# EasyEDA Pro project 25集创赛海云捷讯杯.epro, schematic Schematic1
Board Name: AWC_C4&征途连接板; Create Date: 2025-03-02; Page Name: P1; Project Name: 25集创赛海云捷讯杯; Schematic Name: Schematic1; Update Date: 2025-03-21; Company: 嘉立创EDA; Page Size: A4; Version: V1.0
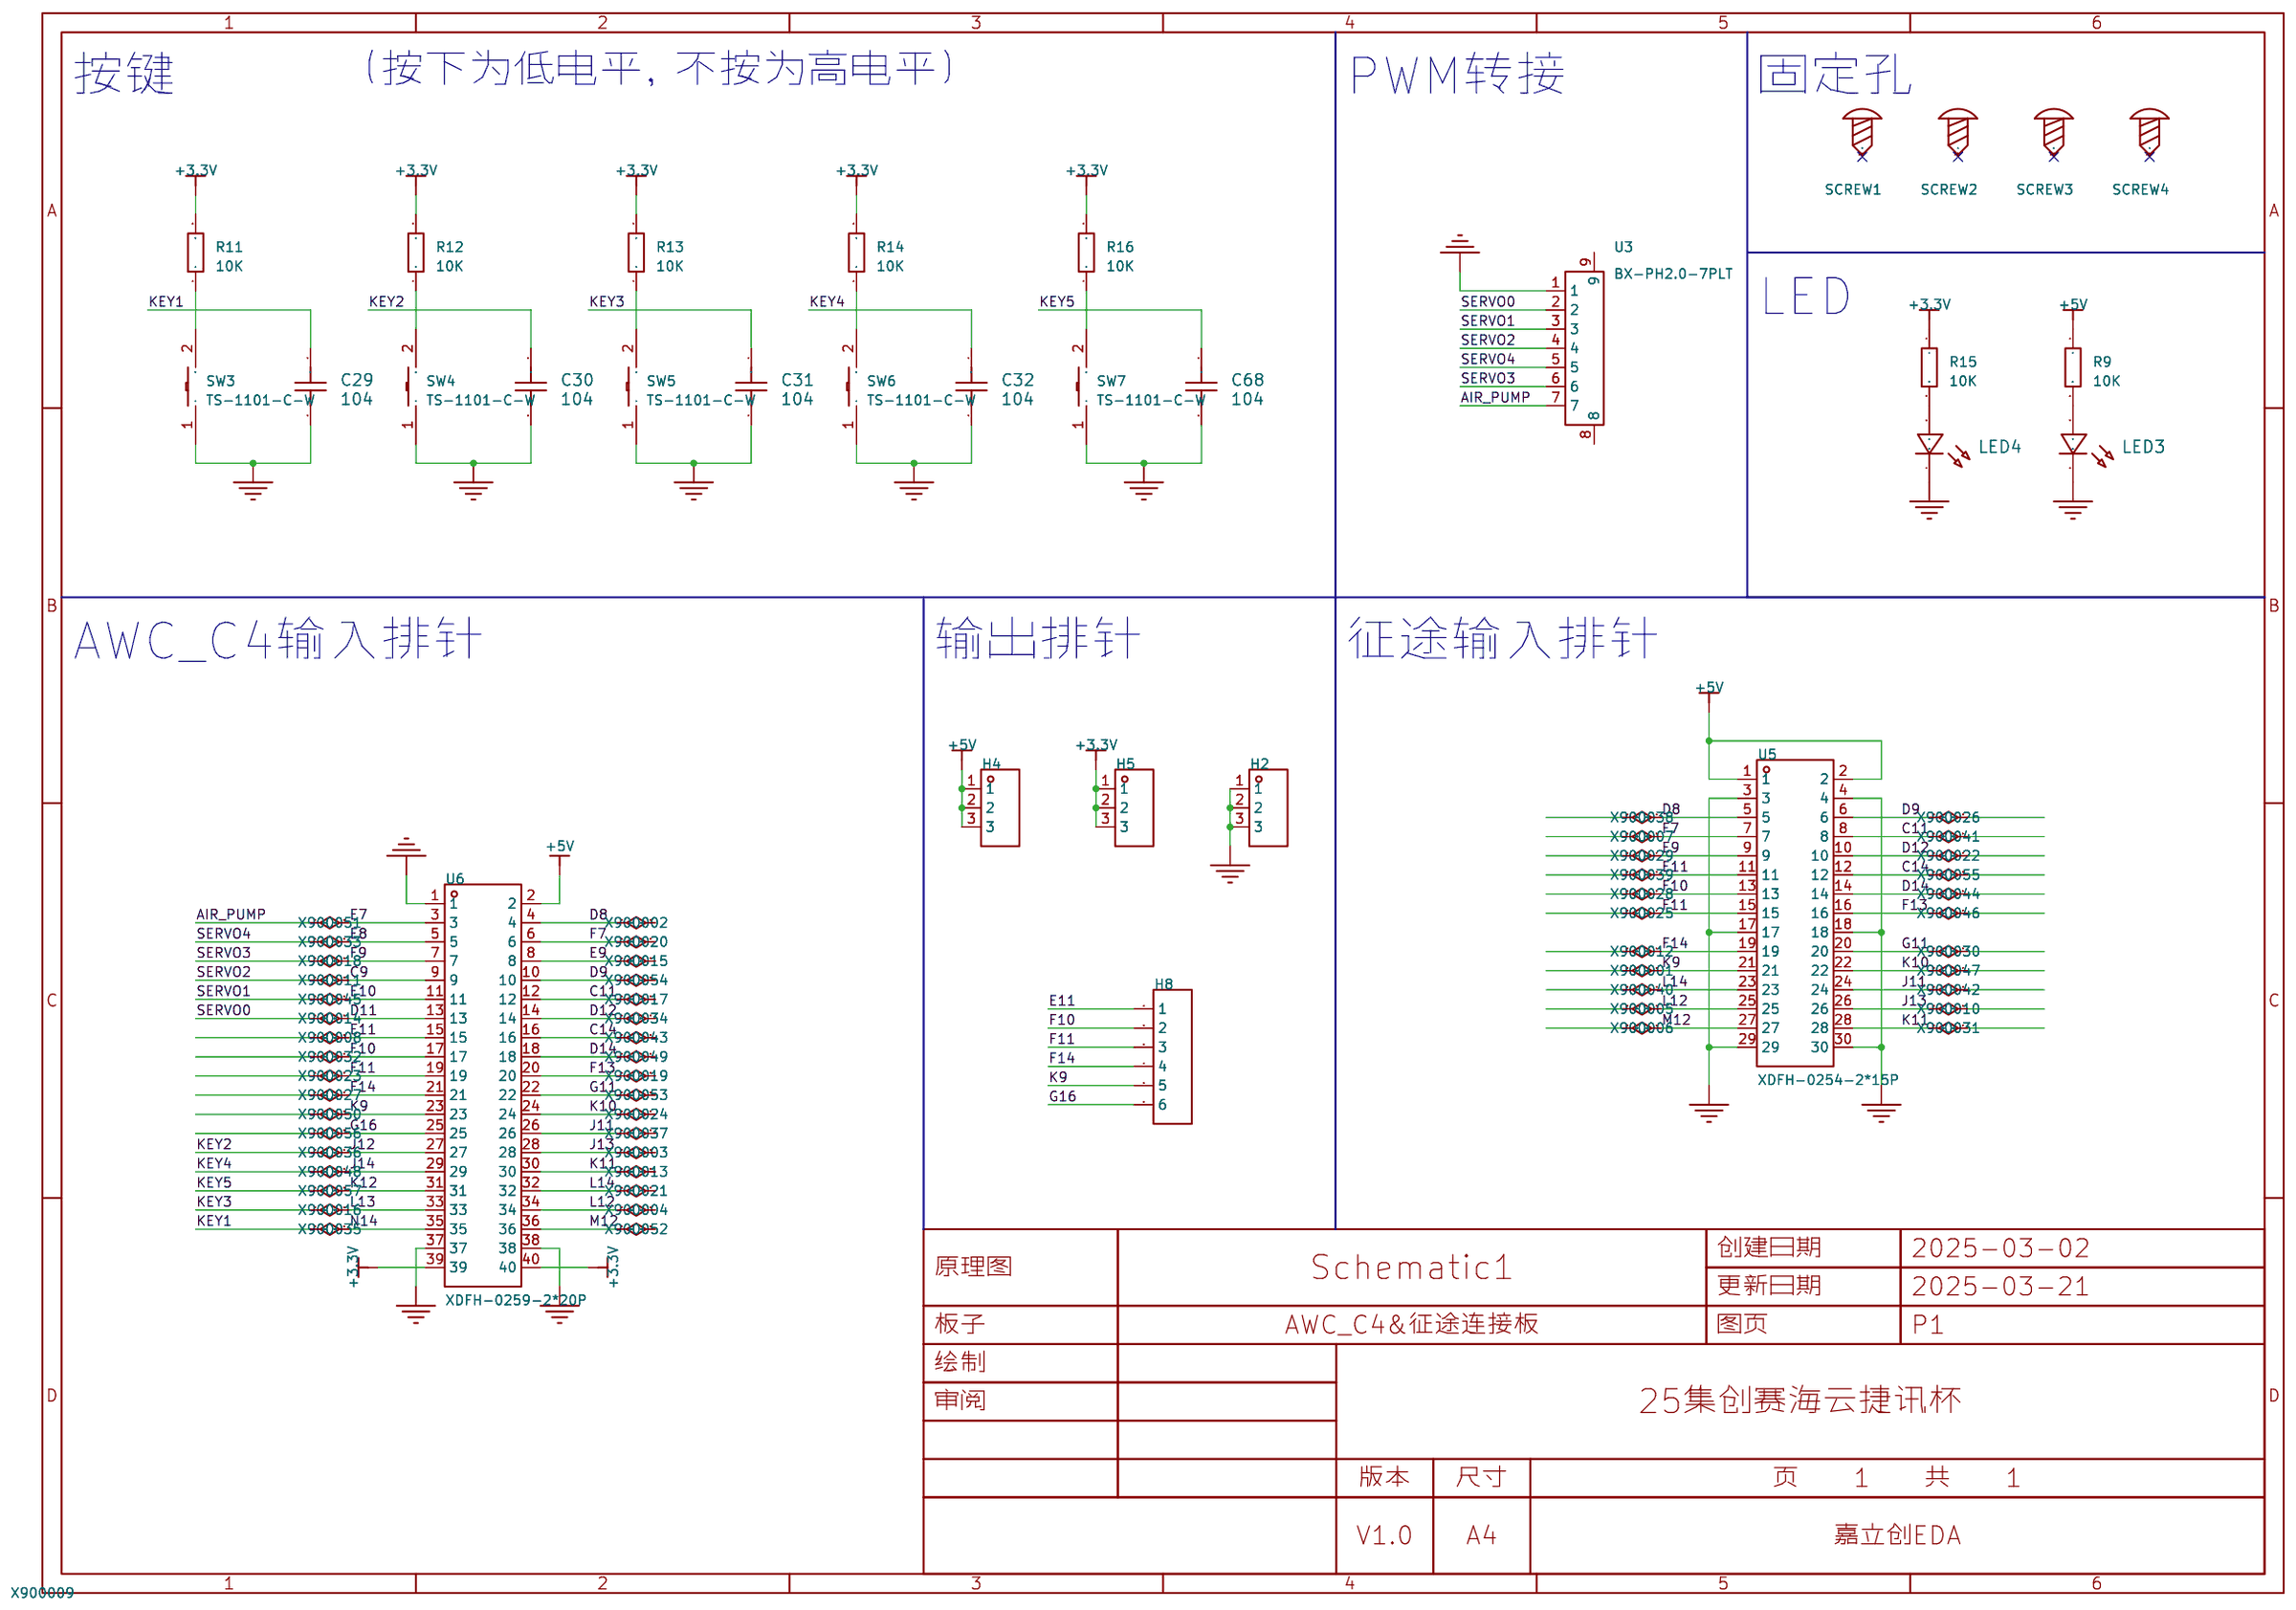
[diagram p2: schematic sheet]

## Parts
C29  104  [c0805]
C30  104  [c0805]
C31  104  [c0805]
C32  104  [c0805]
C68  104  [c0805]
H2  -  [HDR-TH_3P-P2.54-V-F]
H4  -  [HDR-TH_3P-P2.54-V-F]
H5  -  [HDR-TH_3P-P2.54-V-F]
H8  -  [HDR-TH_6P-P2.54-V-M-1]
LED3  -  [LED_0805]
LED4  -  [LED_0805]
R9  10K  [R0805]
R11  10K  [R0805]
R12  10K  [R0805]
R13  10K  [R0805]
R14  10K  [R0805]
R15  10K  [R0805]
R16  10K  [R0805]
SCREW1  -  [M4螺丝]
SCREW2  -  [M4螺丝]
SCREW3  -  [M4螺丝]
SCREW4  -  [M4螺丝]
SW3  TS-1101-C-W  [SW-SMD_L6.0-W3.3-LS8.0]
SW4  TS-1101-C-W  [SW-SMD_L6.0-W3.3-LS8.0]
SW5  TS-1101-C-W  [SW-SMD_L6.0-W3.3-LS8.0]
SW6  TS-1101-C-W  [SW-SMD_L6.0-W3.3-LS8.0]
SW7  TS-1101-C-W  [SW-SMD_L6.0-W3.3-LS8.0]
U3  BX-PH2.0-7PLT  [CONN-SMD_7P-P2.00_WAFER-200L-7P]
U5  XDFH-0254-2*15P  [CONN-TH_30P-P2.54_LX_XDFH-0254-2X15P]
U6  XDFH-0259-2*20P  [CONN-TH_40P-P2.54_LX_XDFH-0259-2X20P]

## Library data of the parts
C29-C32 C68 = 4.7u
H2 H4 H5 = HDR-F_2.54_1x3P: Supplier Part: C541850; Supplier Footprint: 插件
H8 = HDR-M_2.54_1x6P: Supplier Part: C37208; Supplier Footprint: 插件
LED3 LED4 = LED_0805-R: Supplier Footprint: 0805
R9 R11-R16 = Res_0805: Supplier Footprint: 0805
SCREW1-SCREW4 = M4螺丝: Supplier Footprint: 插件
SW3-SW7 = TS-1101-C-W: 电路结构:单刀单掷;按钮形状:矩形按钮;作用力:260gf;安装方式:立贴;开关长度:6mm;开关宽度:3.6mm;开关高度:2.5mm;带支架:不带;触点电流:50mA;额定电压(AC):-;额定电压(DC):12V;额定功率:-;绝缘电阻:-;带灯:无;机械寿命:5万次;; LCSC Part Name: 6*3.6*2.5mm 立贴 轻触开关; Supplier Part: C318938; Manufacturer: XKB Connectivity(中国星坤); Supplier Footprint: SMD; JLCPCB Part Class: Extended Part; Datasheet: https://atta.szlcsc.com/upload/public/pdf/source/20200227/C318938_C2E53B1EEDE37D980A33616AC086DE53.pdf; Supplier: LCSC; Circuit: 单刀单掷; Actuator Style: 矩形按钮; Operating Force: 260gf; Mounting Style: 立贴; Switch Length: 6mm; Switch Width: 3.6mm; Switch Height: 2.5mm; Strike Gundam: 不带; Contact Current: 50mA; Voltage Rating (DC): 12V; Actuator/Cap Color: 白色带淡绿; With Lamp: 无; Mechanical Life: 5万次; Operating Temperature: -30℃~+85℃
U3 = BX-PH2.0-7PLT: 插针结构:1x7P;间距:2mm;安装方式:立贴;参考系列:PH;总PIN数:7P;排数:1;每排PIN数:7;行距:-;额定电流:2A;触头材质:黄铜;触头镀层:锡;工作温度:-25℃~+85℃;; LCSC Part Name: 1x7P 间距:2mm 立贴 系列:PH; Supplier Part: C18077904; Manufacturer: Bossie(博锡); Supplier Footprint: SMD,P=2mm; JLCPCB Part Class: 扩展库; Datasheet: https://atta.szlcsc.com/upload/public/pdf/source/20231017/5967BA8EE4B66594EE88FDB4BB623991.pdf; Supplier: LCSC; Pins Structure: 1x7P; Pitch: 2mm; Mounting Type: 立贴; Reference Series: PH; Number of Pins: 7P; Number of Rows: 1; Number of PINs Per Row: 7; Current Rating: 2A; Contact Material: 黄铜; Contact Plating: 锡; Operating Temperature: -25℃~+85℃; Voltage Rating: 250V; Plastic Material: LCP; Supplementary Features: 辅助焊脚; Color: 米色; Z-Height of the Board: 6.3mm; X-Length of Bottom Edge on Board (Spacing Line): 18mm; Y-Width of Bottom Edge on Board: 7.5mm
U5 = XDFH-0254-2*15P: 连接器类型:简牛座;间距:2.54mm;结构:2x15P;额定电流:3A;额定电压:500V;封装形式:直插;排数:2;每排PIN数:15;触头材质:铜;触头镀层:金;工作温度范围:-45℃~+105℃;焊接温度(最大值):260℃;; LCSC Part Name: 镀2U全金品质简牛插座PH2.54MM-2*15PIN直插板 DIP; Supplier Part: C19193814; Manufacturer: LX(连欣科技); Supplier Footprint: 插件,P=2.54mm; JLCPCB Part Class: 扩展库; Datasheet: https://atta.szlcsc.com/upload/public/pdf/source/20231117/B05B179C28F8598ADEE3EE3DBCADEC41.pdf; Supplier: LCSC; Connector Type: 简牛座; Pitch: 2.54mm; Structure: 2x15P; Current Rating (Max): 3A; Voltage Rating (Max): 500V; Holder Type: 直插; Number of Rows: 2; Pin Number in each Row: 15; Contact Material: 铜; Contact Plating: 金; Operating Temperature Range: -45℃~+105℃; Soldering Temperature(Max): 260℃
U6 = XDFH-0259-2*20P: 连接器类型:简牛座;间距:2.54mm;结构:2x20P;额定电流:3A;额定电压:500V;封装形式:弯插;排数:2;每排PIN数:20;触头材质:铜;触头镀层:金;工作温度范围:-45℃~+105℃;; LCSC Part Name: 2U镀金PH2.54MM-2*20PIN卧插简牛插座专用; Supplier Part: C19193829; Manufacturer: LX(连欣科技); Supplier Footprint: 弯插,P=2.54mm; JLCPCB Part Class: 扩展库; Datasheet: https://atta.szlcsc.com/upload/public/pdf/source/20231117/460E6BB7C0FB7D45FB9AB0ED1A0F90C2.pdf; Supplier: LCSC; Connector Type: 简牛座; Pitch: 2.54mm; Structure: 2x20P; Current Rating (Max): 3A; Voltage Rating (Max): 500V; Holder Type: 弯插; Number of Rows: 2; Pin Number in each Row: 20; Contact Material: 铜; Contact Plating: 金; Operating Temperature Range: -45℃~+105℃

## Nets
+3.3V: H5.1 H5.2 H5.3 R11.2 R12.2 R13.2 R14.2 R15.1 R16.2 U6.39 U6.40
+5V: H4.1 H4.2 H4.3 R9.1 U5.1 U5.2 U6.2
GND: C29.2 C30.2 C31.2 C32.2 C68.2 H2.1 H2.2 H2.3 LED3.1(C) LED4.1(C) SW3.1 SW4.1 SW5.1 SW6.1 SW7.1 U3.1 U5.3 U5.4 U5.17 U5.18 U5.29 U5.30 U6.1 U6.37 U6.38
AIR_PUMP: U3.7 U6.3
C9: U3.4 U6.9
C11: U5.8 U6.12
C14: U5.12 U6.16
D8: U5.5 U6.4
D9: U5.6 U6.10
D11: U3.2 U6.13
D12: U5.10 U6.14
D14: U5.14 U6.18
E8: U3.5 U6.5
E9: U5.9 U6.8
E10: U3.3 U6.11
E11: H8.1 U5.11 U6.15
F7: U5.7 U6.6
F9: U3.6 U6.7
F10: H8.2 U5.13 U6.17
F11: H8.3 U5.15 U6.19
F13: U5.16 U6.20
F14: H8.4 U5.19 U6.21
G11: U5.20 U6.22
G16: H8.6 U6.25
J11: U5.24 U6.26
J12: C30.1 R12.1 SW4.2 U6.27
J13: U5.26 U6.28
J14: C32.1 R14.1 SW6.2 U6.29
K9: H8.5 U5.21 U6.23
K10: U5.22 U6.24
K11: U5.28 U6.30
K12: C68.1 R16.1 SW7.2 U6.31
KEY1: C29.1 R11.1 SW3.2 U6.35
KEY3: C31.1 R13.1 SW5.2 U6.33
L12: U5.25 U6.34
L14: U5.23 U6.32
M12: U5.27 U6.36
$1N2036: LED3.2(A) R9.2
$1N2039: LED4.2(A) R15.2

Not connected (* = marked no-connect by the designer): SCREW1 1*; SCREW2 1*; SCREW3 1*; SCREW4 1*; U3 8 9

## Notes on the sheet
- （按下为低电平，不按为高电平）
- 按键
- PWM转接
- 固定孔
- LED
- AWC_C4输入排针
- 输出排针
- 征途输入排针
